# EAGLE design pwr_section (EAGLE 6.4)
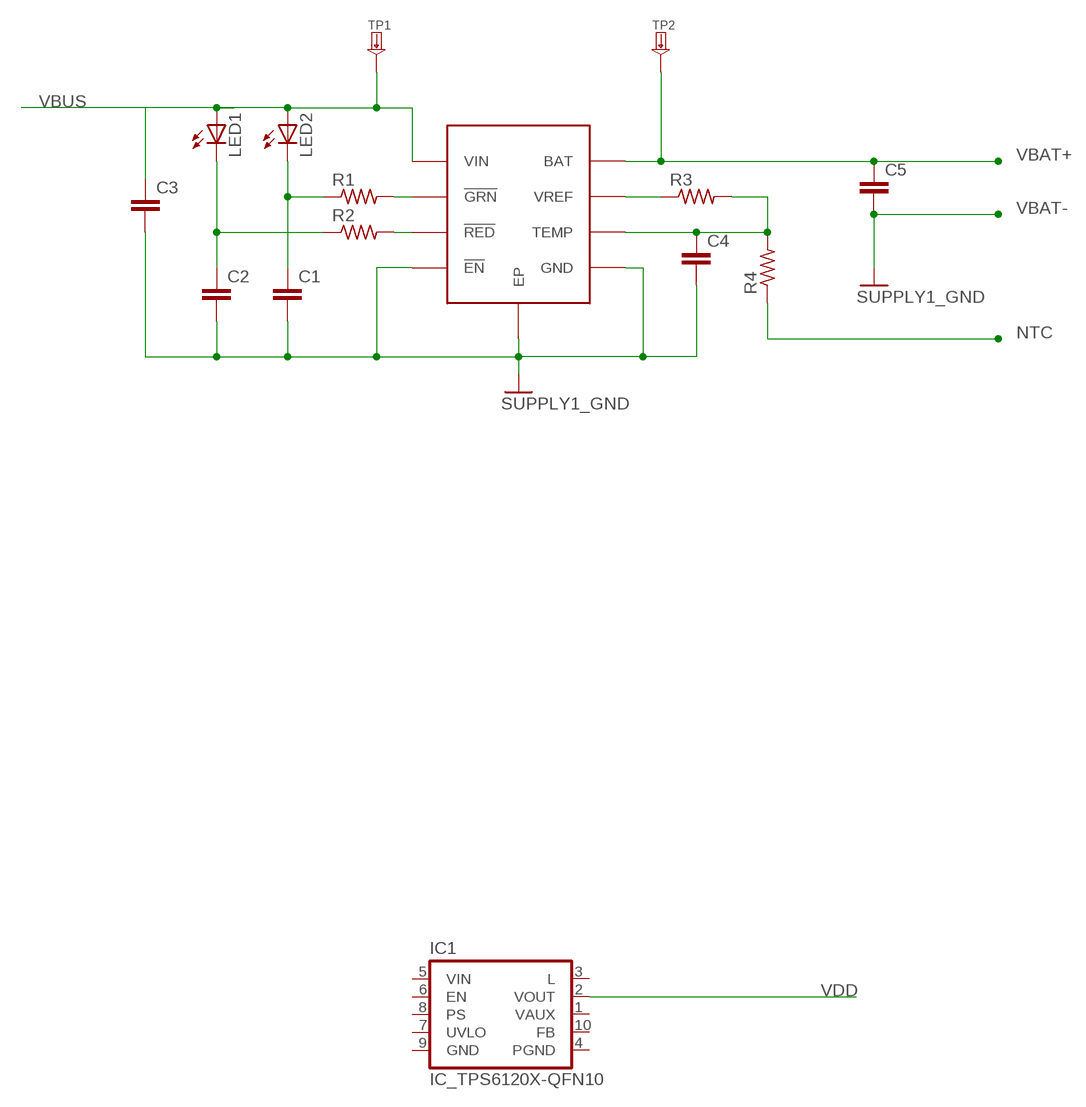
[diagram p0: schematic, sheet 1]

## Parts
C1  SPARKFUN_CAP0603-CAP  [SPARKFUN_0603-CAP]
C2  SPARKFUN_CAP0603-CAP  [SPARKFUN_0603-CAP]
C3  SPARKFUN_CAP0603-CAP  [SPARKFUN_0603-CAP]
C4  SPARKFUN_CAP0603-CAP  [SPARKFUN_0603-CAP]
C5  SPARKFUN_CAP0603-CAP  [SPARKFUN_0603-CAP]
IC1  IC_TPS6120X-QFN10  [QFN-10]
LED1  LED_LEDCHIP-LED0603  [LED_CHIP-LED0603]
LED2  LED_LEDCHIP-LED0603  [LED_CHIP-LED0603]
R1  RCL_R-US_R0603  [RCL_R0603]
R2  RCL_R-US_R0603  [RCL_R0603]
R3  RCL_R-US_R0603  [RCL_R0603]
R4  RCL_R-US_R0603  [RCL_R0603]
TP1  --MERGED_TESTPADKEYSTONE-SMD  [--MERGED_KEYSTONE-SMD-TESTPOINT-5015]
TP2  --MERGED_TESTPADKEYSTONE-SMD  [--MERGED_KEYSTONE-SMD-TESTPOINT-5015]
U$1  MC34674  [UDFN-EP]

## Nets
GND: C1.2 C2.2 C3.2 C4.2 U$1.4(!EN) U$1.5(GND) U$1.9(EP) ; supply symbol labelled SUPPLY1_GND
N$1: C1.1 LED2.C R1.1
N$2: R1.2 U$1.2(!GRN)
N$3: C2.1 LED1.C R2.1
N$4: R2.2 U$1.3(!RED)
N$7: R3.1 U$1.7(VREF)
N$8: C4.1 R3.2 R4.2 U$1.6(TEMP)
NTC: R4.1
VBAT+: C5.1 TP2.1 U$1.8(BAT)
VBAT-: C5.2 ; supply symbol labelled SUPPLY1_GND
VBUS: C3.1 LED1.A LED2.A TP1.1 U$1.1(VIN)
VDD: IC1.2(VOUT)
Unconnected: IC1.1(VAUX) IC1.3(L) IC1.4(PGND) IC1.5(VIN) IC1.6(EN) IC1.7(UVLO) IC1.8(PS) IC1.9(GND) IC1.10(FB) IC1.P0(GND) IC1.P1(GND) IC1.P2(GND) IC1.P3(GND) IC1.P4(GND) IC1.V0(GND) IC1.V1(GND)

## Library data of the parts
C1-C5 = badge.lbrbadge_2013:SPARKFUN_CAP: Capacitor Standard 0603 ceramic capacitor, and 0.1" leaded capacitor.
IC1 = dp_devices:IC_TPS6120X: Low input voltage Synchronous Boost converter
LED1 LED2 = badge.lbrbadge_2013:LED_LED: LED OSRAM: - CHIPLED LG R971, LG N971, LY N971, LG Q971, LY Q971, LO R971, LY R971 LH N974, LH R974 LS Q976, LO Q976, LY Q976 LO Q996 - Hyper CHIPLED LW Q18S LB Q993, LB Q99A, LB R99A - SideLED LS A670, LO A670, LY A670, LG A670, LP A670 LB A673, LV A673, LT A673, LW A673 LH A674 LY A675 LS A676, LA A676, LO A676, LY A676, LW A676 LS A679, LY A679, LG A679 - Hyper Micro SIDELED® LS Y876, LA Y876, LO Y876, LY Y876 LT Y87S - SmartLED LW L88C, LW L88S LB L89C, LB L89S, LG L890 LS L89K, LO L89K, LY L89K LS L896, LA L896, LO L896, LY L896 - TOPLED LS T670, LO T670, LY T670, LG T670, LP T670 LSG T670, LSP T670, LSY T670, LOP T670, LYG T670 LG T671, LOG T671, LSG T671 LB T673, LV T673, LT T673, LW T673 LH T674 LS T676, LA T676, LO T676, LY T676, LB T676, LH T676, LSB T676, LW T676 LB T67C, LV T67C, LT T67C, LS T67K, LO T67K, LY T67K, LW E67C LS E67B, LA E67B, LO E67B, LY E67B, LB E67C, LV E67C, LT E67C LW T67C LS T679, LY T679, LG T679 LS T770, LO T770, LY T770, LG T770, LP T770 LB T773, LV T773, LT T773, LW T773 LH T774 LS E675, LA E675, LY E675, LS T675 LS T776, LA T776, LO T776, LY T776, LB T776 LHGB T686 LT T68C, LB T68C - Hyper Mini TOPLED® LB M676 - Mini TOPLED Santana® LG M470 LS M47K, LO M47K, LY M47K Source: http://www.osram.convergy.de LUXEON: - LUMILED® LXK2-PW12-R00, LXK2-PW12-S00, LXK2-PW14-U00, LXK2-PW14-V00 LXK2-PM12-R00, LXK2-PM12-S00, LXK2-PM14-U00 LXK2-PE12-Q00, LXK2-PE12-R00, LXK2-PE12-S00, LXK2-PE14-T00, LXK2-PE14-U00 LXK2-PB12-K00, LXK2-PB12-L00, LXK2-PB12-M00, LXK2-PB14-N00, LXK2-PB14-P00, LXK2-PB14-Q00 LXK2-PR12-L00, LXK2-PR12-M00, LXK2-PR14-Q00, LXK2-PR14-R00 LXK2-PD12-Q00, LXK2-PD12-R00, LXK2-PD12-S00 LXK2-PH12-R00, LXK2-PH12-S00 LXK2-PL12-P00, LXK2-PL12-Q00, LXK2-PL12-R00 Source: www.luxeon.com KINGBRIGHT: KA-3528ASYC Source: www.kingbright.com
R1-R4 = badge.lbrbadge_2013:RCL_R-US_: RESISTOR, American symbol
TP1 TP2 = STM32-PROX:--MERGED_TESTPAD
U$1 = STM32-PROX:MC34674

## Board
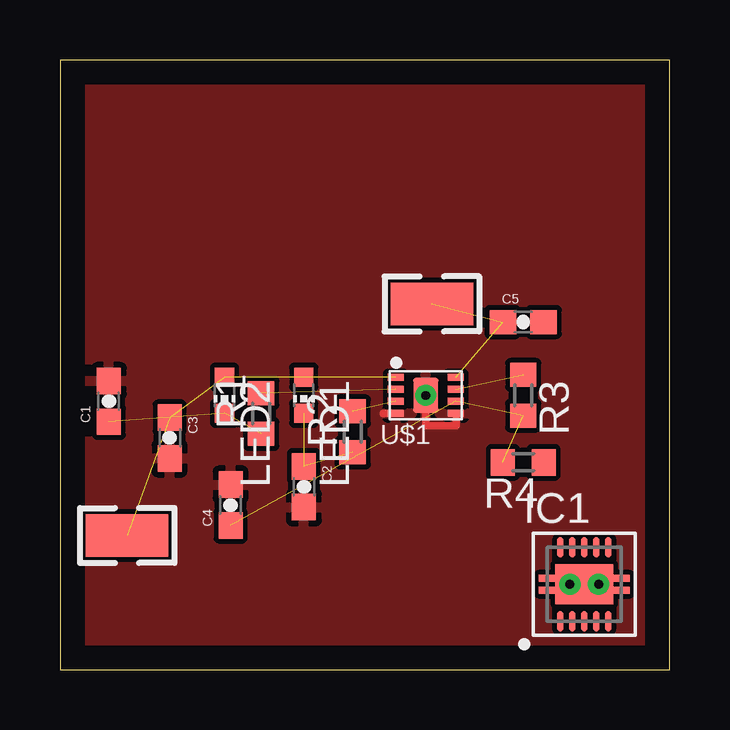
[diagram p1: board, top side]

Size 25.4 x 25.4 mm. Coordinates in mm from the lower left corner, seen from the top.
Outline: 0,0 25.4,0 25.4,25.4 0,25.4 0,0
Copper layers (1*16): Top 0.035mm / dielectric 1.5mm / Bottom 0.035mm
Design rules "default": minimum track width 10mil, minimum drill 24mil, track to track 8mil, track to pad 8mil, pad to pad 8mil, via to via 8mil, smd to smd 8mil, copper to edge 40mil, drill to drill 8mil, minimum pad ring 10mil, minimum via ring 8mil, stop-mask expansion 4mil, vias tented up to drill 0mil, thermal gap 10mil

### Footprints (pad centres in the part's own frame; a part is rotated, then mirrored left to right if it is on the bottom)
SPARKFUN_0603-CAP = smd 1.1 x 1: 1 -0.85,0; 2 0.85,0
QFN-10 = smd 0.28 x 0.85: 1 -1,-1.545; 2 -0.5,-1.545; 3 0,-1.545; 4 0.5,-1.545; 5 1,-1.545; 6 1,1.545; 7 0.5,1.545; 8 0,1.545; 9 -0.5,1.545; 10 -1,1.545 | smd 2.4 x 1.65: P0 0,0 | smd 0.7 x 0.28: P1 -1.55,-0.25; P2 1.55,-0.25; P3 1.55,0.25; P4 -1.55,0.25 | drill 0.381: V0 -0.6,0; V1 0.6,0
LED_CHIP-LED0603 = smd 0.8 x 0.8: A 0,-0.75; C 0,0.75
RCL_R0603 = smd 1 x 1.1: 1 -0.85,0; 2 0.85,0
--MERGED_KEYSTONE-SMD-TESTPOINT-5015 = smd 3.429 x 1.778: 1 0,0
UDFN-EP = smd 0.3 x 0.65: 1 -0.75,-1.25; 2 -0.25,-1.25; 3 0.25,-1.25; 4 0.75,-1.25; 5 0.75,1.25; 6 0.25,1.25; 7 -0.25,1.25; 8 -0.75,1.25 | smd 1.45 x 1.05: 9 0,0 | drill 0.356: 10 0,0

### Placement (x,y rotation side)
C1  2.03,11.18 90 top
C2  10.16,7.62 270 top
C3  4.57,9.65 270 top
C4  7.11,6.86 90 top
C5  19.3,14.48 0 top
IC1  21.84,3.56 0 top
LED1  10.16,11.43 180 top
LED2  6.86,11.43 180 top
R1  8.38,10.67 90 top
R2  12.19,9.91 90 top
R3  19.3,11.43 270 top
R4  19.3,8.64 180 top
TP1  2.79,5.59 0 top
TP2  15.49,15.24 0 top
U$1  15.24,11.43 270 top

### Tracks (layer width: path | path; a pad name or v marks a point on that pad's centre or on a via)
GND
  Top 0.305: U$1.4 13.46,10.68 13.46,10.67 | U$1.9 15.24,10.16 16.51,10.16 16.51,10.67
  pour Top: -0.76,26.42 26.92,26.42 26.92,-1.27 -0.76,-1.27
N$1  (2 unrouted)
N$2  (1 unrouted)
N$3  (2 unrouted)
N$4  (1 unrouted)
N$7  (1 unrouted)
N$8  (3 unrouted)
VBAT+  (2 unrouted)
VBUS  (4 unrouted)